# Altium schematic sheet Sheet1.SchDoc
size 863 x 558 mm; SheetNumber: 1; SheetTotal: 1
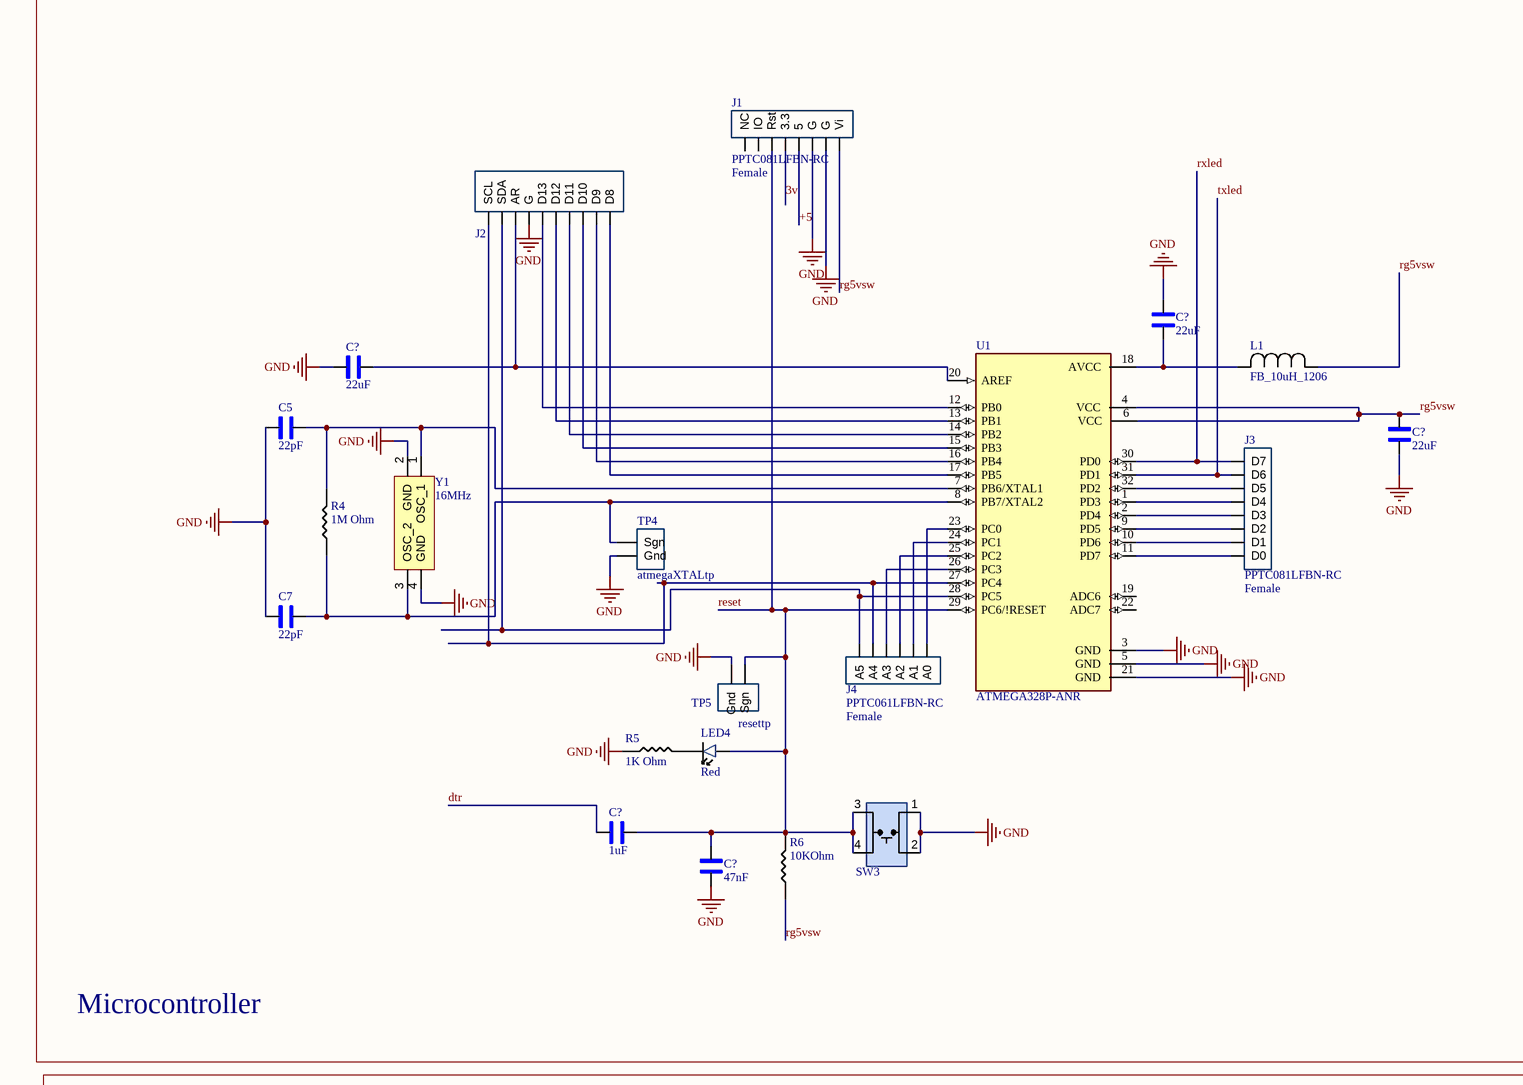
[diagram p0: Sheet1.SchDoc, top left]
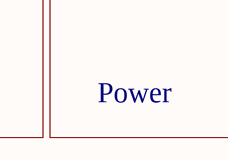
[diagram p1: Sheet1.SchDoc, top middle]
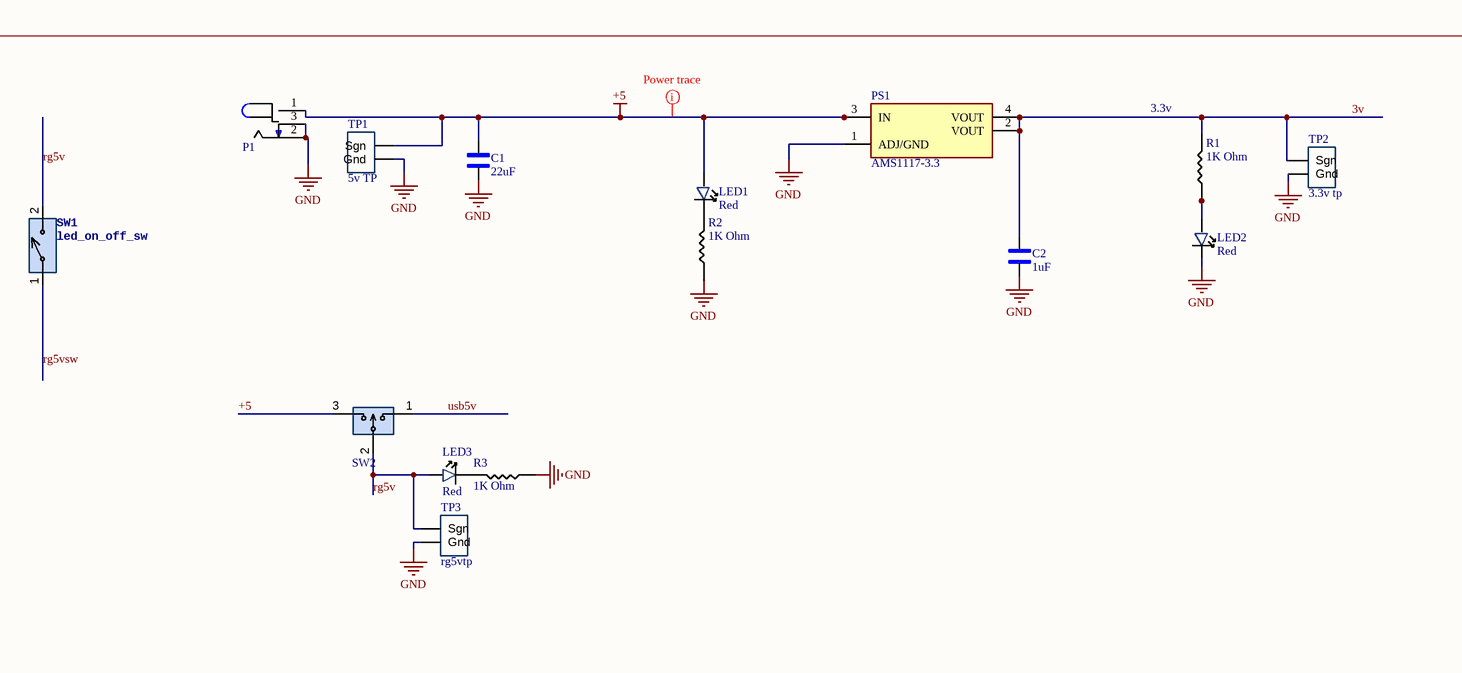
[diagram p2: Sheet1.SchDoc, top right]
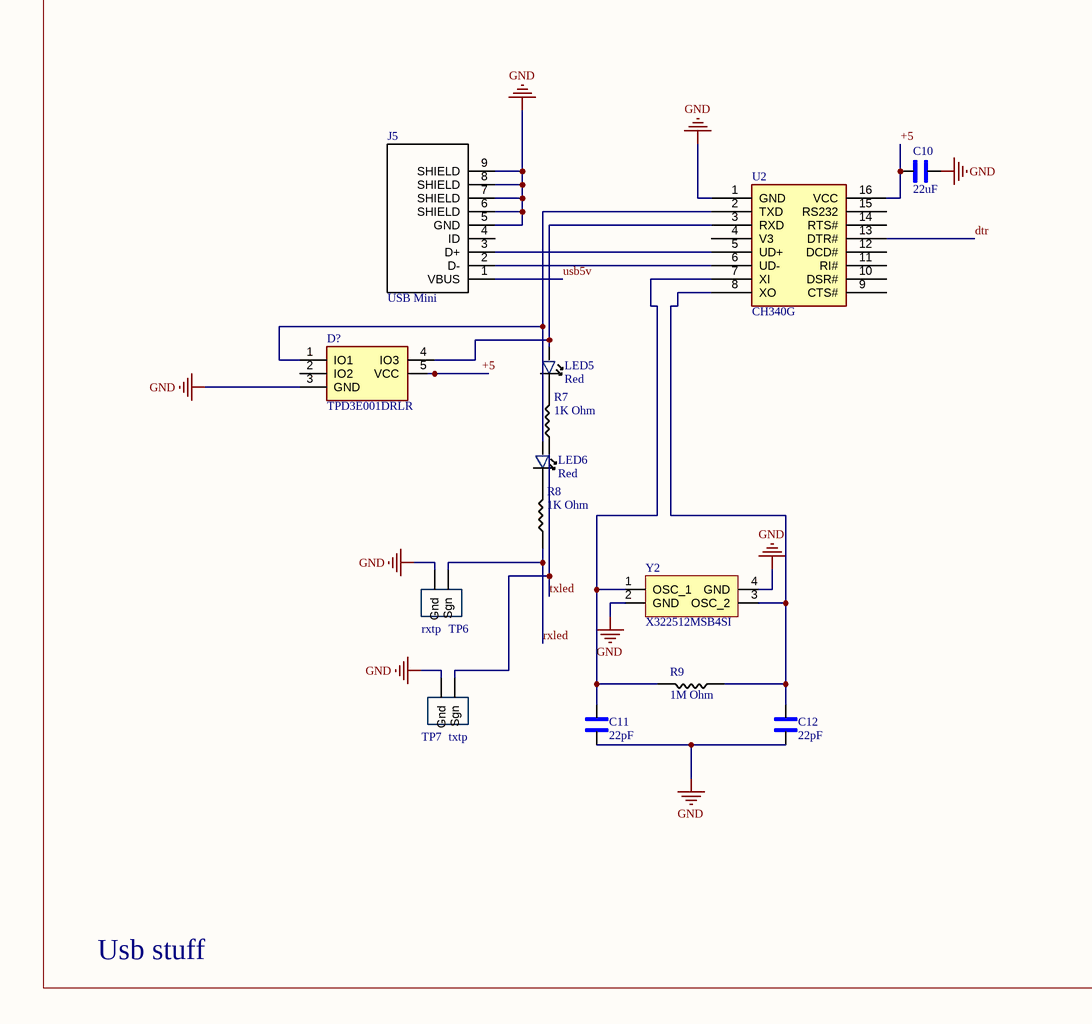
[diagram p3: Sheet1.SchDoc, bottom left]

## Parts
(Parts that share a designator on the sheet are numbered #1, #2 ... from top to bottom, then left to right.)
C1  22uF  [1206_Passive_Capacitor]
C2  1uF  [1206_Passive_Capacitor]
C5  22pF  [1206_Passive_Capacitor]
C7  22pF  [1206_Passive_Capacitor]
C10  22uF  [1206_Passive_Capacitor]
C11  22pF  [1206_Passive_Capacitor]
C12  22pF  [1206_Passive_Capacitor]
C?#1  22uF  [1206_Passive_Capacitor]
C?#2  22uF  [1206_Passive_Capacitor]
C?#3  22uF  [1206_Passive_Capacitor]
C?#4  1uF  [1206_Passive_Capacitor]
C?#5  47nF  [1206_Passive_Capacitor]
D?  TPD3E001DRLR  [SOTFL50P160X60-5N]
J1  PPTC081LFBN-RC  value Female  [8_PIN_ARD-PWR_100MIL]
J2  PPTC101LFBN-RC  [10_PIN_ARDUINO_100MIL]  (value not drawn)
J3  PPTC081LFBN-RC  value Female  [8_PIN_ARD-DIG_100MIL]
J4  PPTC061LFBN-RC  value Female  [6_PIN_ARD-Analog_100mil]
J5  USB Mini  [USB_MINI_B]
L1  FB_10uH_1206  [AIML-1206_ABR-M]
LED1  Red  [LED_1206]
LED2  Red  [LED_1206]
LED3  Red  [LED_1206]
LED4  Red  [LED_1206]
LED5  Red  [LED_1206]
LED6  Red  [LED_1206]
P1  Power Jack  [Power_Jack]  (value not drawn)
PS1  AMS1117-3.3  [LDO]
R1  value 1K Ohm  [1206_Passive_Resitor]  (hidden comment: 1k)
R2  value 1K Ohm  [1206_Passive_Resitor]  (hidden comment: 1k)
R3  value 1K Ohm  [1206_Passive_Resitor]  (hidden comment: 1k)
R4  value 1M Ohm  [1206_Passive_Resitor]  (hidden comment: 1M)
R5  value 1K Ohm  [1206_Passive_Resitor]  (hidden comment: 1k)
R6  value 10KOhm  [1206_Passive_Resitor]  (hidden comment: 10k)
R7  value 1K Ohm  [1206_Passive_Resitor]  (hidden comment: 1k)
R8  value 1K Ohm  [1206_Passive_Resitor]  (hidden comment: 1k)
R9  value 1M Ohm  [1206_Passive_Resitor]  (hidden comment: 1M)
SW1  led_on_off_sw  [2Pin-Header-Conn]
SW2  PREC003SAAN-RC  [3_PIN_100mil]  (value not drawn)
SW3  TL3305AF160QG  [Switch_JLC]  (value not drawn)
TP1  5v TP  [TP10x_Probe]
TP2  3.3v tp  [TP10x_Probe]
TP3  rg5vtp  [TP10x_Probe]
TP4  atmegaXTALtp  [TP10x_Probe]
TP5  resettp  [TP10x_Probe]
TP6  rxtp  [TP10x_Probe]
TP7  txtp  [TP10x_Probe]
U1  ATMEGA328P-ANR  [ATMega328P]
U2  CH340G  [USB to serial]
Y1  value 16MHz  [Crystal resonator]  (hidden comment: X322516MLB4SI)
Y2  X322512MSB4SI  [Crystal resonator]

## Blocks framed on the sheet
Microcontroller: C5 C7 C?#1-C?#5 J1-J4 L1 LED4 R4-R6 SW3 TP4 TP5 U1 Y1
Power: C1 C2 LED1-LED3 P1 PS1 R1-R3 SW1 SW2 TP1-TP3
Usb stuff: C10-C12 D? J5 LED5 LED6 R7-R9 TP6 TP7 U2 Y2

## Nets
+5: C1.2 C10.1 D?.5(VCC) J1.5 LED1.1 P1.1 PS1.3(IN) SW2.3 TP1.1(Sgn) U2.16(VCC)
GND: C1.1 C2.1 C5.1 C7.1 C10.2 C11.1 C12.1 C?#1.2 C?#2.2 C?#3.1 C?#5.1 D?.3(GND) J1.6(G) J1.7(G) J2.4(G) J5.5(GND) J5.6(SHIELD) J5.7(SHIELD) J5.8(SHIELD) J5.9(SHIELD) LED2.2 P1.2 P1.3 PS1.1(ADJ/GND) R2.1 R3.1 R5.1 SW3.1 SW3.2 TP1.2(Gnd) TP2.2(Gnd) TP3.2(Gnd) TP4.2(Gnd) TP5.2(Gnd) TP6.2(Gnd) TP7.2(Gnd) U1.3(GND) U1.5(GND) U1.21(GND) U2.1(GND) Y1.2(GND) Y1.4(GND) Y2.2(GND) Y2.4(GND)
3v: C2.2 J1.4(3.3) PS1.2(VOUT) PS1.4(VOUT) R1.2 TP2.1(Sgn)
dtr: C?#4.1 U2.13(DTR#)
reset: C?#4.2 C?#5.2 J1.3(Rst) LED4.1 R6.2 SW3.3 SW3.4 TP5.1(Sgn) U1.29(PC6/!RESET)
rg5v: LED3.1 SW1.2 SW2.2 TP3.1(Sgn)
rg5vsw: C?#3.2 J1.8(Vi) L1.1 R6.1 SW1.1 U1.4(VCC) U1.6(VCC)
rxled: J3.1(D7) R8.1 TP6.1(Sgn) U1.30(PD0)
txled: J3.2(D6) R7.1 TP7.1(Sgn) U1.31(PD1)
usb5v: J5.1(VBUS) SW2.1
NetC5_2: C5.2 R4.2 U1.7(PB6/XTAL1) Y1.1(OSC_1)
NetC7_2: C7.2 R4.1 TP4.1(Sgn) U1.8(PB7/XTAL2) Y1.3(OSC_2)
NetC11_2: C11.2 R9.2 U2.7(XI) Y2.1(OSC_1)
NetC12_2: C12.2 R9.1 U2.8(XO) Y2.3(OSC_2)
NetC?#1_1: C?#1.1 L1.2 U1.18(AVCC)
NetC?#2_1: C?#2.1 J2.3(AR) U1.20(AREF)
NetD?_1: D?.1(IO1) LED6.1 U2.2(TXD)
NetD?_4: D?.4(IO3) LED5.1 U2.3(RXD)
NetJ2_1: J2.1(SCL) J4.5(A4) U1.27(PC4)
NetJ2_2: J2.2(SDA) J4.6(A5) U1.28(PC5)
NetJ2_5: J2.5(D13) U1.12(PB0)
NetJ2_6: J2.6(D12) U1.13(PB1)
NetJ2_7: J2.7(D11) U1.14(PB2)
NetJ2_8: J2.8(D10) U1.15(PB3)
NetJ2_9: J2.9(D9) U1.16(PB4)
NetJ2_10: J2.10(D8) U1.17(PB5)
NetJ3_3: J3.3(D5) U1.32(PD2)
NetJ3_4: J3.4(D4) U1.1(PD3)
NetJ3_5: J3.5(D3) U1.2(PD4)
NetJ3_6: J3.6(D2) U1.9(PD5)
NetJ3_7: J3.7(D1) U1.10(PD6)
NetJ3_8: J3.8(D0) U1.11(PD7)
NetJ4_1: J4.1(A0) U1.23(PC0)
NetJ4_2: J4.2(A1) U1.24(PC1)
NetJ4_3: J4.3(A2) U1.25(PC2)
NetJ4_4: J4.4(A3) U1.26(PC3)
NetJ5_2: J5.2(D-) U2.6(UD-)
NetJ5_3: J5.3(D+) U2.5(UD+)
NetLED1_2: LED1.2 R2.2
NetLED2_1: LED2.1 R1.1
NetLED3_2: LED3.2 R3.2
NetLED4_2: LED4.2 R5.2
NetLED5_2: LED5.2 R7.2
NetLED6_2: LED6.2 R8.2

Not connected (* = marked no-connect by the designer): D? 2(IO2); J1 1(NC) 2(IO); J5 4(ID); U1 19(ADC6) 22(ADC7); U2 4(V3) 9(CTS#) 10(DSR#) 11(RI#) 12(DCD#) 14(RTS#) 15(RS232)

## Layout directives
rule Width Constraint [Pref Width = 20mil    Min Width = 10mil    Max Width = 100mil]: +5

## Notes on the sheet
- (near R1) 3.3v
- DWG. NO.
- REV.
- SHT.
- REVISION
- DESCRIPTION
- DATE
- APPROVED
- THIS DOCUMENT AND THE DATA DISCLOSED HEREIN OR HEREWITH IS THE PROPERTY OF ALTIUM LIMITED AND MAY BE FREELY DISTRIBUTED IN WHOLE. NO RIGHTS ARE RESERVED OR EXPRESS OR IMPLIED WARANTEE GIVEN.
- ENG:
- DSN:
- APPROVALS
- PROJECT
- DOCUMENT REVISION:
- DESIGN ITEM:
- CHK:
- BOM:
- REFERENCE DOCUMENTS
- PROJECT REVISION:
- TITLE
- FAB DWG:
- PCB DWG:
- ASSY DWG:
- SCALE:
- SIZE
- D
- CAGE CODE
- FILE NAME
- DWG NO.
- SHEET
- OF
- REV

## Library data of the parts
C1 C10 C?#1-C?#3 = C_22uF_1206: 22uF ±10% 25V X5R 1206 Multilayer Ceramic Capacitors MLCC - SMD/SMT RoHS; MFR Part #: CL31A226KAHNNNE; Type: basic; LCSC Part#: C12891; Datasheet: https://datasheet.lcsc.com/lcsc/1811031514_Samsung-Electro-Mechanics-CL31A226KAHNNNE_C12891.pdf; Value: 22uF
C2 C?#4 = C_1uF_1206: MULTILAYER CERAMIC CAPACITORS MLCC - SMD/SMT 1UF 50V 1206 ROHS; MFR Part #: CL31B105KBHNNNE; Type: Basic; Digikey Link: https://www.digikey.com/product-detail/en/C1206C105M4RACTU/399-8150-1-ND/3471873/?itemSeq=304982366; LCSC Part#: C1848; Value: 1uF
C5 C7 C11 C12 = C_22pF_1206: 22pF ±5% 1kV C0G 1206 Multilayer Ceramic Capacitors MLCC - SMD/SMT RoHS; MFR Part #: CC1206JKNPOCBN220; Type: Extended; LCSC Part#: C107174; Datasheet: https://datasheet.lcsc.com/lcsc/1810241219_YAGEO-CC1206JKNPOCBN220_C107174.pdf; Value: 22pF
C?#5 = C_47nF_1206: 47nF ±5% 50V C0G 1206 Multilayer Ceramic Capacitors MLCC - SMD/SMT RoHS; MFR Part #: GRM31M5C1H473JA01L; Type: Extended; LCSC Part#: C21812; Datasheet: https://datasheet.lcsc.com/lcsc/1810201313_Murata-Electronics-GRM31M5C1H473JA01L_C21812.pdf; Value: 47nF
D? = TPD3E001DRLR: Low-Capacitance 3-Channel +/-15KV ESD-Protection Array for High-Speed Data Interfaces; Manufacturer_Name: Texas Instruments; Geometry.Height: 0.6mm; Mouser Part Number: 595-TPD3E001DRLR; Mouser Price/Stock: https://www.mouser.co.uk/ProductDetail/Texas-Instruments/TPD3E001DRLR?qs=t6sYTo5dwUz70OwW3s2cQw%3D%3D; Manufacturer_Part_Number: TPD3E001DRLR; Datasheet Link: http://www.ti.com/lit/ds/symlink/tpd3e001.pdf
J1 = JF_8_PIN_FEMA_ARD-Pwr: 8 Position Header Connector 0.100" (2.54mm) Through Hole Tin; Digikey Link: https://www.digikey.com/product-detail/en/PPTC081LFBN-RC/S7006-ND/810147/?itemSeq=304982354; MFR Part #: PPTC081LFBN-RC; Type: Extended; LCSC Part#: C27438
J2 = JF_10_PIN_FEMA_ARDUINO: 10 Position Header Connector 0.100" (2.54mm) Through Hole Tin; Value: Female; Digikey Link: https://www.digikey.com/product-detail/en/PPTC101LFBN-RC/S7008-ND/810149/?itemSeq=304982352; MFR Part #: PPTC101LFBN-RC; LCSC Part#: C225507; Type: Extended
J3 = JF_8_PIN_FEMA_ARD-Dig: 8 Position Header Connector 0.100" (2.54mm) Through Hole Tin; Digikey Link: https://www.digikey.com/product-detail/en/PPTC081LFBN-RC/S7006-ND/810147/?itemSeq=304982354; MFR Part #: PPTC081LFBN-RC; Type: Extended; LCSC Part#: C27438
J4 = JF_6_PIN_FEMA_ARD-Anolog: 6 Position Header Connector 0.100" (2.54mm) Through Hole Tin; Digikey Link: https://www.digikey.com/product-detail/en/PPTC061LFBN-RC/S7004-ND/810145/?itemSeq=304982353; MFR Part #: PPTC061LFBN-RC; LCSC Part#: C40877; Type: Extended
J5 = J_USB_B_Mini: Through Hole USB Connectors RoHS; MFR Part #: 920-462A2021D10102; Value: USB mini B; LCSC Part#: C46398; Datasheet: https://datasheet.lcsc.com/szlcsc/2103081233_Jing-Extension-of-the-Electronic-Co-920-462A2021D10102_C46398.pdf; Type: Extended
L1 = FB_10uH_1206: 25mA 10uH ±10% 800mΩ 1206  Inductors (SMD) ROHS; Mfr_Name: FH (Guangdong Fenghua Advanced Tech); MFR PART #: CMI321609X100KT; Type: Basic; LCSC PART#: C1051; DataSheet: https://datasheet.lcsc.com/lcsc/1810311314_FH--Guangdong-Fenghua-Advanced-Tech-CMI321609X100KT_C1051.pdf
LED1-LED6 = LED_RED_1206: Red 621~631nm 1206 Light Emitting Diodes (LED) RoHS; MFR Part #: 15-21/R6C-FQ1R1B/2T; Type: Extended; LCSC Part#: C93133; Datasheet: https://datasheet.lcsc.com/szlcsc/1811151241_Everlight-Elec-15-21-R6C-FQ1R1B-2T_C93133.pdf; Value: Red
P1 = P_Power Jack: Power Barrel Connector Jack 2.10mm ID (0.083"), 5.50mm OD (0.217") Through Hole, Right Angle; MFR Part #: PJ-102A; Value: CONN PWR JACK 2X5.5MM SOLDER; Digikey Link: https://www.digikey.com/product-detail/en/PJ-102A/CP-102A-ND/275425/?itemSeq=304982367; LCSC Part#: C136744; Type: Extended
PS1 = PS_AMS_LDO_3v3: LOW DROPOUT REGULATORS(LDO) POSITIVE FIXED 1.3V @ 800MA 15V 3.3V 1A SOT-223 ROHS; Value: IC REG LINEAR 3.3V 800MA SOT223; MFR Part #: AMS1117-3.3; LCSC Part#: C6186; Type: Basic
R1-R3 R5 R7 R8 = R_1K_1206: CHIP RESISTOR - SURFACE MOUNT 1KOHMS ±1% 1/4W 1206 ROHS; MFR Part #: RNCP1206FTD1K00CT; Digikey Link: https://www.digikey.com/product-detail/en/RNCP1206FTD1K00/RNCP1206FTD1K00CT-ND/2240675/?itemSeq=304982373; LCSC Part#: C4410; Type: Basic
R4 R9 = R_1M_1206: CHIP RESISTOR - SURFACE MOUNT 1MOHMS ±1% 1/4W 1206 ROHS; MFR Part #: RMCF1206JT1M00; Digikey Link: https://www.digikey.com/product-detail/en/RMCF1206JT1M00/RMCF1206JT1M00CT-ND/1942830/?itemSeq=304982358; LCSC Part#: C17927; Type: Basic
R6 = R_10KOhm_1206: 10 kOhms ±5% 0.25W, 1/4W Chip Resistor 1206 (3216 Metric) Automotive AEC-Q200 Thick Film; MFR Part #: RMCF1206FT10K0; Digikey Link: https://www.digikey.com/en/products/detail/stackpole-electronics-inc/RMCF1206FT10K0/1759669; LCSC Part#: C17902; Type: Basic
SW1 = SW_2Pin_100mil_Switch: 2Pin Header; LCSC Part#: C124375; Type: Extended
SW2 = SW_3Pin_100mil_Switch: Connector Header Through Hole 3 position 0.100" (2.54mm); Value: CONN HEADER VERT 3POS 2.54MM; Digikey Link: https://www.digikey.com/product-detail/en/PREC003SAAN-RC/S1012EC-03-ND/2774851/?itemSeq=304982371; MFR Part #: PREC003SAAN-RC; Type: Extended; LCSC Part#: C49257
SW3 = SW_Push_Button_JLC: Tactile Switch SPST-NO Top Actuated Surface Mount; MFR Part #: KH-4.5X4.5X4.3H-STM; LCSC Part#: C2837550; Type: Extended; DataSheet: https://datasheet.lcsc.com/lcsc/2106081532_Shenzhen-Kinghelm-Elec-KH-4.5X4.5X4.3H-STM_C2837550.pdf
TP1-TP7 = TP_10x_Probe: Test Point 300 mil centers
U1 = U_ATMega328P: AVR AVR® ATmega Microcontroller IC 8-Bit 20MHz 32KB (16K x 16) FLASH 32-TQFP (7x7); MFR Part #: ATMEGA328P-AU; Value: IC MCU 8BIT 32KB FLASH 32TQFP; Digikey Link: https://www.digikey.com/product-detail/en/ATMEGA328P-ANR/ATMEGA328P-ANRCT-ND/2774230/?itemSeq=304982365; LCSC Part#: C14877; Type: Basic
U2 = U_USBtoSerial: Transceiver USB 2.0 2Mbps SOP-16_150mil USB ICs RoHS; Datasheet: https://datasheet.lcsc.com/lcsc/2008191806_WCH-Jiangsu-Qin-Heng-CH340G_C14267.pdf; LCSC Part#: C14267; MFR Part #: CH340G; Type: Basic; Value: USB to Serial
Y1 = X_16Mhz_Res: ±10ppm 16000000Hz -40℃~85℃ 贴片无源晶振 60Ω 9pF SMD3225-4P Crystals ROHS; LCSC Part#: C13738; MFR Part #: X322516MLB4SI; Type: Basic
Y2 = X_12MHz_Res: SMD Crystal Resonators 12MHz ±10ppm SMD-3225_4P RoHS; LCSC Part#: C9002; MFR Part #: X322512MSB4SI; Value: 12MHz; Type: Basic; Datasheet: https://datasheet.lcsc.com/szlcsc/Yangxing-Tech-X322512MSB4SI_C9002.pdf